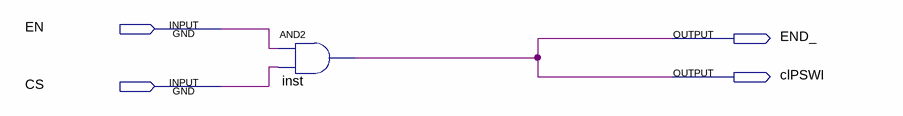
[diagram p0: schematic sheet]
// Quartus schematic CLI.bdf as structural Verilog: 1 symbols, 4 pins
module CLI (
  input  EN,
  input  CS,
  output END_,
  output clPSWI
);

  and inst (clPSWI, EN, CS);

  assign END_ = clPSWI;
endmodule
